# EAGLE schematic Schaltplan (EAGLE 6.5.0)
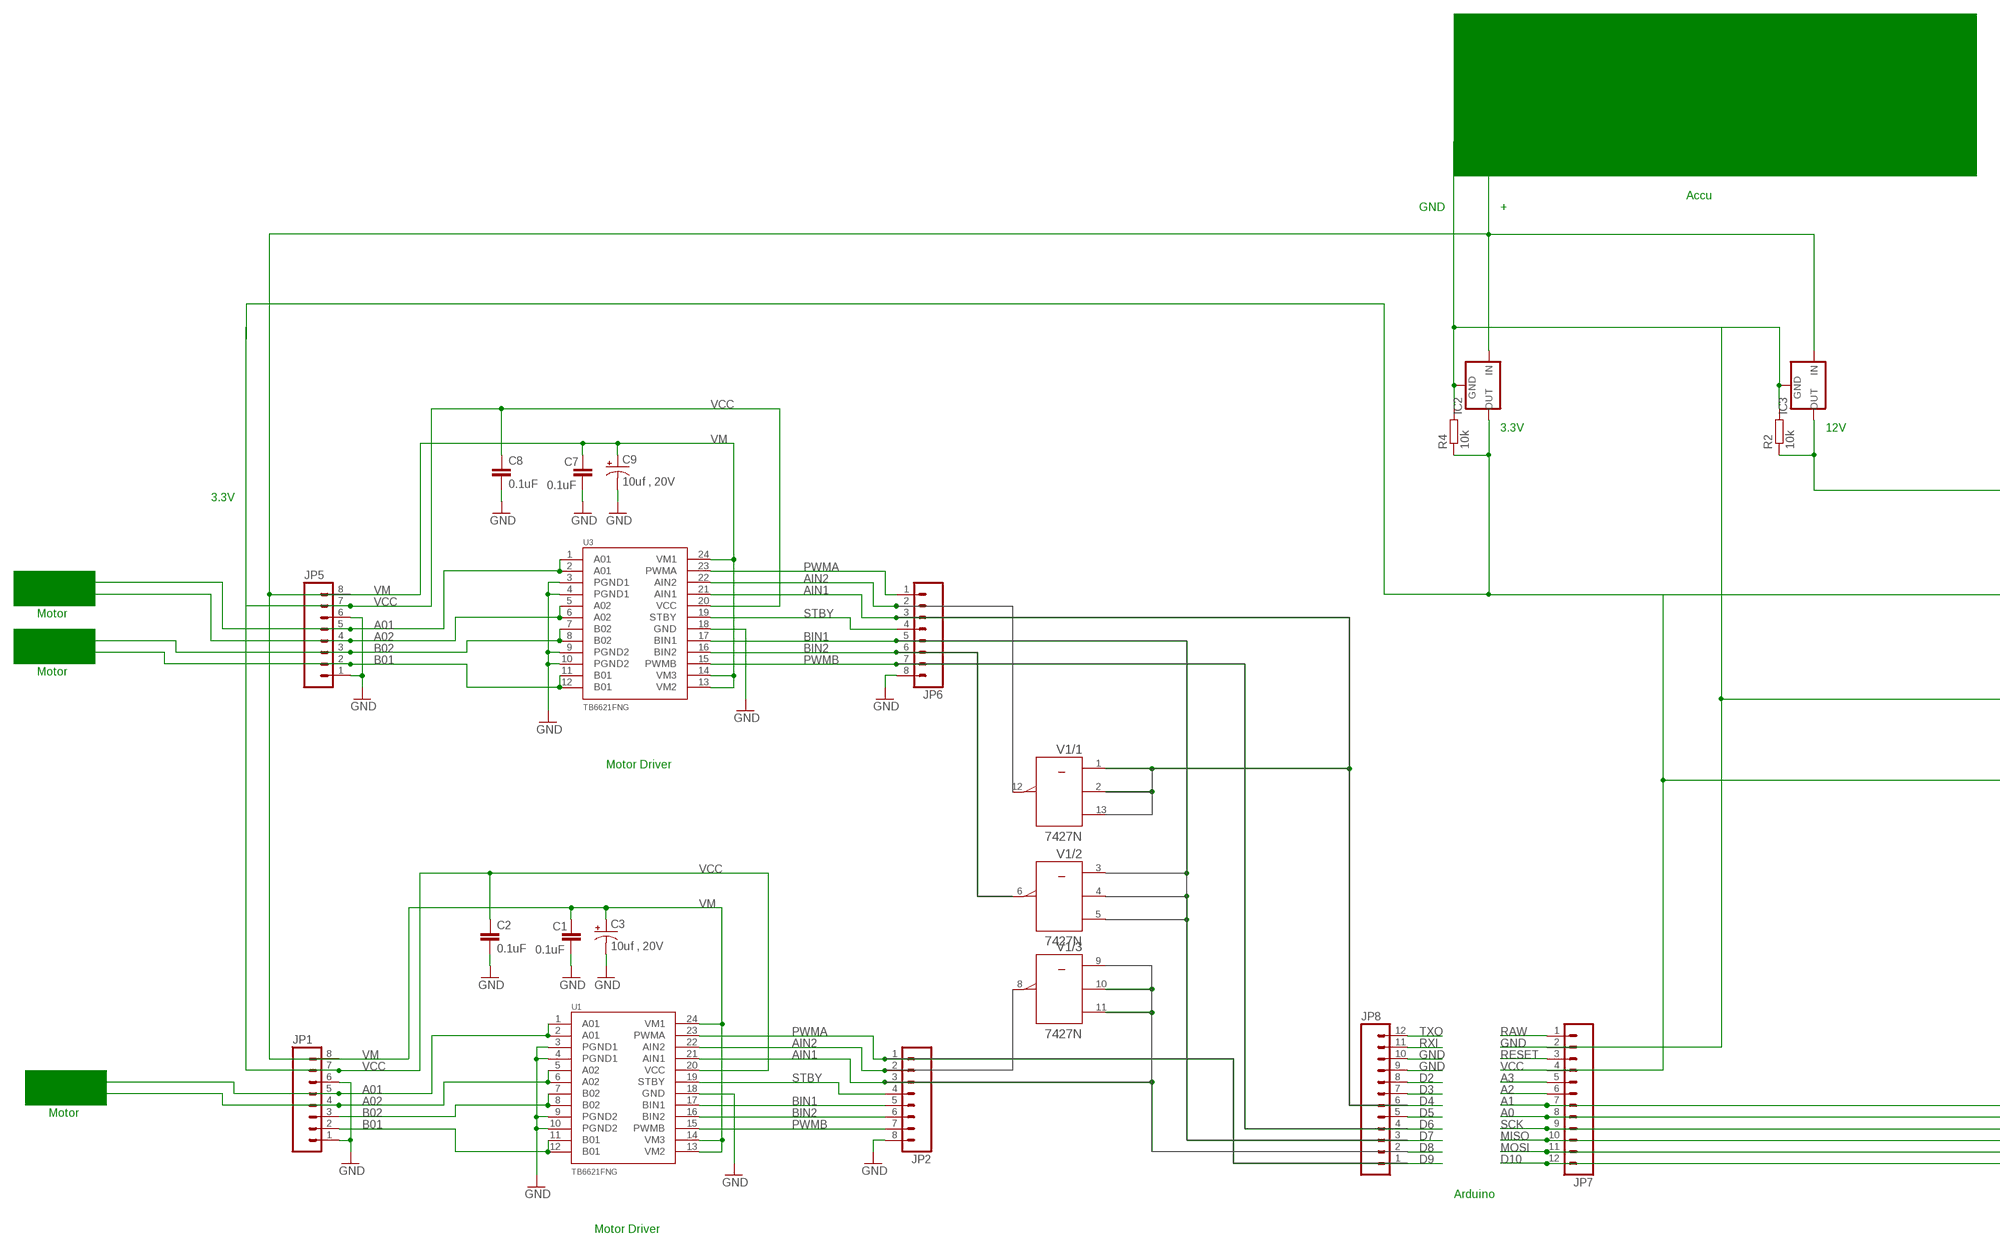
[diagram p0: schematic, sheet 1, part 1 of 2]
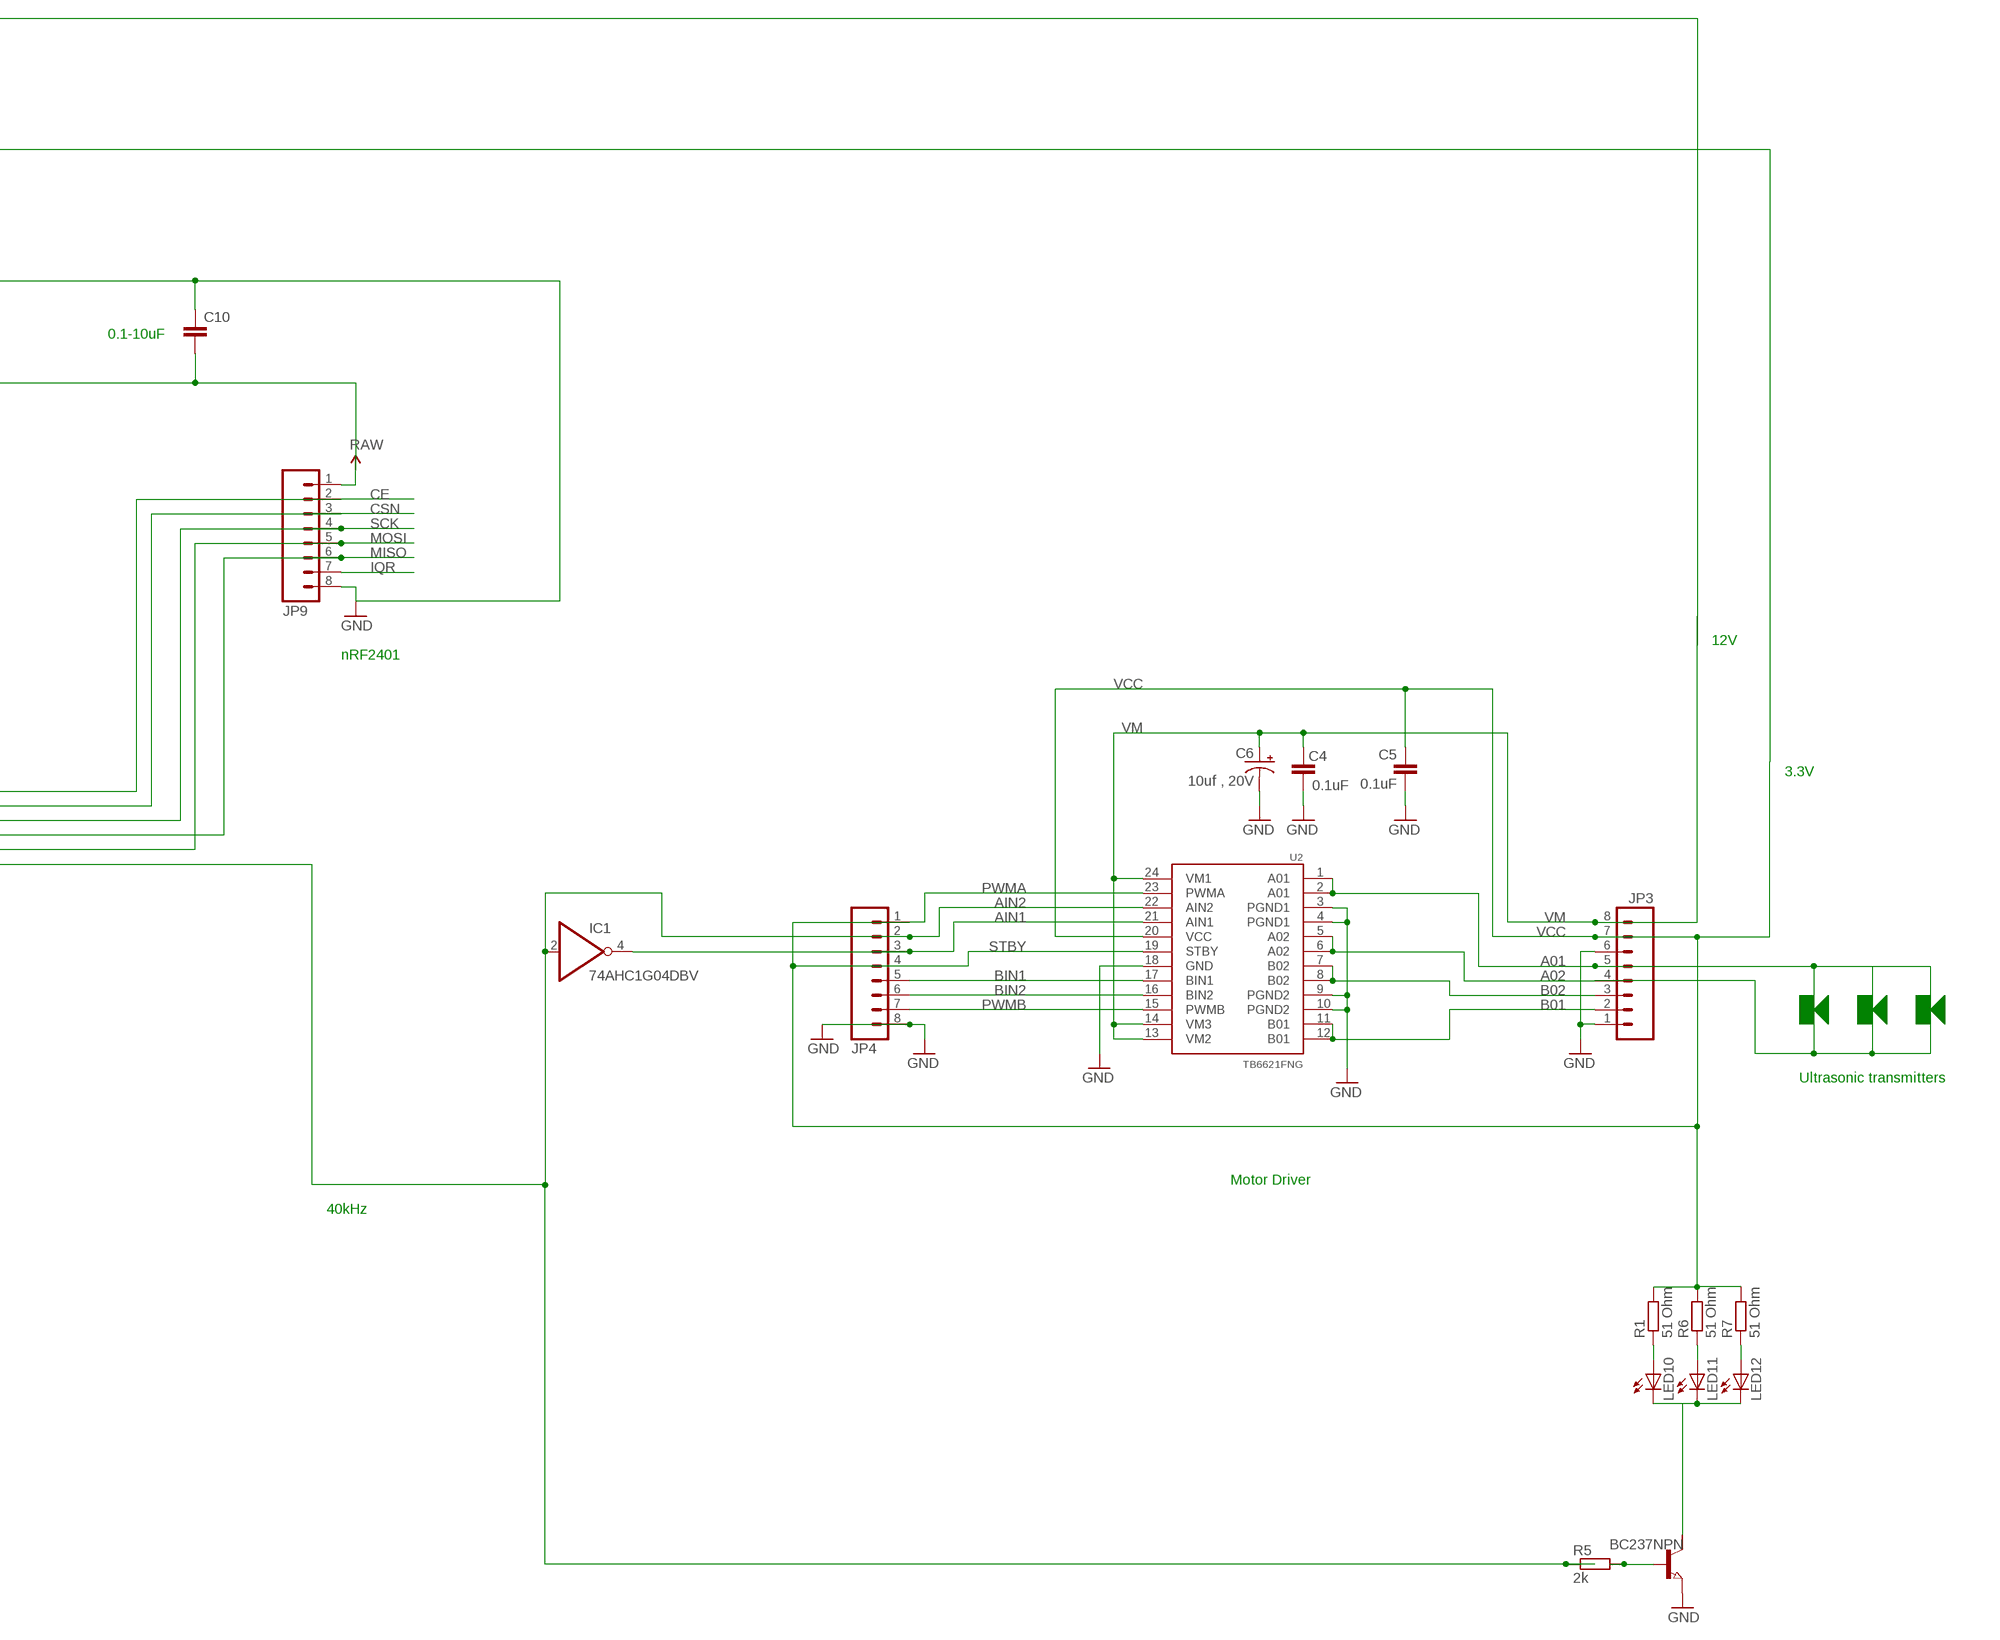
[diagram p1: schematic, sheet 1, part 2 of 2]

## Parts
BC237NPN  NPN-TRANSISTIOR-2COLSOT89  [SOT89]
C1  0.1uF  CAP0402-CAP  [0402-CAP]
C2  0.1uF  CAP0402-CAP  [0402-CAP]
C3  10uf , 20V  CAP_POL3528  [EIA3528]
C4  0.1uF  CAP0402-CAP  [0402-CAP]
C5  0.1uF  CAP0402-CAP  [0402-CAP]
C6  10uf , 20V  CAP_POL3528  [EIA3528]
C7  0.1uF  CAP0402-CAP  [0402-CAP]
C8  0.1uF  CAP0402-CAP  [0402-CAP]
C9  10uf , 20V  CAP_POL3528  [EIA3528]
C10  C2,5-3  [C2.5-3]
IC1  74AHC1G04DBV  [SOT23-5]
IC2  LM323-TO3  [TO3-K02]
IC3  LM323-TO3  [TO3-K02]
JP1  M08LONGPADS  [1X08_LONGPADS]
JP2  M08LONGPADS  [1X08_LONGPADS]
JP3  M08LONGPADS  [1X08_LONGPADS]
JP4  M08LONGPADS  [1X08_LONGPADS]
JP5  M08LONGPADS  [1X08_LONGPADS]
JP6  M08LONGPADS  [1X08_LONGPADS]
JP7  M12PTH  [1X12]
JP8  M12PTH  [1X12]
JP9  M081X08  [1X08]
LED10  LED  [SMARTLED-TTW]
LED11  LED  [SMARTLED-TTW]
LED12  LED  [SMARTLED-TTW]
R1  51 Ohm  R-EU_0204/2V  [0204V]
R2  10k  R-EU_0204/2V  [0204V]
R4  10k  R-EU_0204/2V  [0204V]
R5  2k  R-EU_0204/2V  [0204V]
R6  51 Ohm  R-EU_0204/2V  [0204V]
R7  51 Ohm  R-EU_0204/2V  [0204V]
U1  TB6621FNG  [SSOP24]
U2  TB6621FNG  [SSOP24]
U3  TB6621FNG  [SSOP24]
V1  7427N  [DIL14]

## Nets
A0: JP7.8
A01: JP1.5 JP3.5 JP5.5 U1.1(A01) U1.2(A01) U2.1(A01) U2.2(A01) U3.1(A01) U3.2(A01)
A1: JP7.7
A02: JP1.4 JP3.4 JP5.4 U1.5(A02) U1.6(A02) U2.5(A02) U2.6(A02) U3.5(A02) U3.6(A02)
A2: JP7.6
A3: JP7.5
AIN1: IC1.4(O) JP2.3 JP4.3 JP6.3 U1.21(AIN1) U2.21(AIN1) U3.21(AIN1) V1.1(/1:A) V1.2(/1:B) V1.9(/3:A) V1.10(/3:B) V1.11(/3:C) V1.13(/1:C)
AIN2: IC1.2(I) JP2.2 JP4.2 JP6.2 R5.1 U1.22(AIN2) U2.22(AIN2) U3.22(AIN2) V1.8(/3:Y) V1.12(/1:Y)
B01: JP1.2 JP3.2 JP5.2 U1.11(B01) U1.12(B01) U2.11(B01) U2.12(B01) U3.11(B01) U3.12(B01)
B02: JP1.3 JP3.3 JP5.3 U1.7(B02) U1.8(B02) U2.7(B02) U2.8(B02) U3.7(B02) U3.8(B02)
BIN1: JP2.5 JP4.5 JP6.5 U1.17(BIN1) U2.17(BIN1) U3.17(BIN1) V1.3(/2:A) V1.4(/2:B) V1.5(/2:C)
BIN2: JP2.6 JP4.6 JP6.6 U1.16(BIN2) U2.16(BIN2) U3.16(BIN2) V1.6(/2:Y)
CE: JP9.2
CSN: JP9.3
D2: JP8.8
D3: JP8.7
D4: JP8.6
D5: JP8.5
D6: JP8.4
D7: JP8.3
D8: JP8.2
D9: JP8.1
D10: JP7.12
GND: BC237NPN.3(E) C1.2 C2.2 C3.C(-) C4.2 C5.2 C6.C(-) C7.2 C8.2 C9.C(-) JP1.1 JP1.6 JP2.8 JP3.1 JP3.6 JP4.8 JP5.1 JP5.6 JP6.8 JP7.2 JP8.9 JP8.10 JP9.8 U1.3(PGND1) U1.4(PGND1) U1.9(PGND2) U1.10(PGND2) U1.18(GND) U2.3(PGND1) U2.4(PGND1) U2.9(PGND2) U2.10(PGND2) U2.18(GND) U3.3(PGND1) U3.4(PGND1) U3.9(PGND2) U3.10(PGND2) U3.18(GND)
IQR: JP9.7
MISO: JP7.10 JP9.6
MOSI: JP7.11 JP9.5
N$2: IC2.2(IN) IC3.2(IN)
N$3: C10.1 IC2.3(GND) IC3.3(GND) R2.2 R4.2
N$4: LED10.A@1(A) R1.1
N$5: LED11.A@1(A) R6.1
N$6: LED12.A@1(A) R7.1
N$7: C10.2 IC2.1(OUT) R4.1
N$8: IC3.1(OUT) R2.1
N$10: BC237NPN.1(B) R5.2
N$11: BC237NPN.2(C) LED10.C@1(C) LED11.C@1(C) LED12.C@1(C)
PWMA: JP2.1 JP4.1 JP6.1 U1.23(PWMA) U2.23(PWMA) U3.23(PWMA)
PWMB: JP2.7 JP4.7 JP6.7 U1.15(PWMB) U2.15(PWMB) U3.15(PWMB)
RAW [vcc]: JP7.1 JP9.1
RESET: JP7.3
RXI: JP8.11
SCK: JP7.9 JP9.4
STBY: JP2.4 JP4.4 JP6.4 U1.19(STBY) U2.19(STBY) U3.19(STBY)
TXO: JP8.12
VCC: C2.1 C5.1 C8.1 JP1.7 JP3.7 JP5.7 JP7.4 R1.2 R6.2 R7.2 U1.20(VCC) U2.20(VCC) U3.20(VCC)
VM: C1.1 C3.A(+) C4.1 C6.A(+) C7.1 C9.A(+) JP1.8 JP3.8 JP5.8 U1.13(VM2) U1.14(VM3) U1.24(VM1) U2.13(VM2) U2.14(VM3) U2.24(VM1) U3.13(VM2) U3.14(VM3) U3.24(VM1)
Unconnected: BC237NPN.2@1(C/)

## Notes on the sheet
- Accu
- GND | +
- 3.3V | 12V
- 3.3V
- Motor
- Motor
- Motor
- 0.1-10uF
- Motor Driver
- 12V
- nRF2401
- 3.3V
- Motor
- Arduino
- Motor Driver
- Ultrasonic transmitters
- Motor Driver
- 40kHz

## Power pins joined to a net without a drawn wire
+UB: V1.14(/+UB:+UB)
-UB: V1.7(/-UB:-UB)
GND: IC1.3(GND)
VCC: IC1.5(VCC)

## Library data of the parts
BC237NPN = semicon-smd-ipc:NPN-TRANSISTIOR-2COL: NPN TRANSISTOR 2 colletor pins
C1 C2 C4 C5 C7 C8 = SparkFun:CAP: Capacitor Standard 0603 ceramic capacitor, and 0.1" leaded capacitor.
C3 C6 C9 = SparkFun:CAP_POL: Capacitor Polarized These are standard SMD and PTH capacitors. Normally 10uF, 47uF, and 100uF in electrolytic and tantalum varieties. Always verify the external diameter of the through hole cap, it varies with capacity, voltage, and manufacturer. The EIA devices should be standard.
C10 = capacitor-wima:C: CAPACITOR naming: grid - package width
IC1 = 74xx-little-de:74*1G04: INVERTER Gate
IC2 IC3 = v-reg:LM323-TO3: VOLTAGE REGULATOR
JP1-JP6 JP9 = SparkFun:M08: Header 8 Standard 8-pin 0.1" header. Use with straight break away headers (SKU : PRT-00116), right angle break away headers (PRT-00553), swiss pins (PRT-00743), machine pins (PRT-00117), and female headers (PRT-00115).
JP7 JP8 = SparkFun:M12: Header 12 Standard 12-pin 0.1" header. Use with straight break away headers (SKU : PRT-00116), right angle break away headers (PRT-00553), swiss pins (PRT-00743), machine pins (PRT-00117), and female headers (PRT-00115).
LED10-LED12 = led:LED: LED OSRAM: - CHIPLED LG R971, LG N971, LY N971, LG Q971, LY Q971, LO R971, LY R971 LH N974, LH R974 LS Q976, LO Q976, LY Q976 LO Q996 - Hyper CHIPLED LW Q18S LB Q993, LB Q99A, LB R99A - SideLED LS A670, LO A670, LY A670, LG A670, LP A670 LB A673, LV A673, LT A673, LW A673 LH A674 LY A675 LS A676, LA A676, LO A676, LY A676, LW A676 LS A679, LY A679, LG A679 - Hyper Micro SIDELED® LS Y876, LA Y876, LO Y876, LY Y876 LT Y87S - SmartLED LW L88C, LW L88S LB L89C, LB L89S, LG L890 LS L89K, LO L89K, LY L89K LS L896, LA L896, LO L896, LY L896 - TOPLED LS T670, LO T670, LY T670, LG T670, LP T670 LSG T670, LSP T670, LSY T670, LOP T670, LYG T670 LG T671, LOG T671, LSG T671 LB T673, LV T673, LT T673, LW T673 LH T674 LS T676, LA T676, LO T676, LY T676, LB T676, LH T676, LSB T676, LW T676 LB T67C, LV T67C, LT T67C, LS T67K, LO T67K, LY T67K, LW E67C LS E67B, LA E67B, LO E67B, LY E67B, LB E67C, LV E67C, LT E67C LW T67C LS T679, LY T679, LG T679 LS T770, LO T770, LY T770, LG T770, LP T770 LB T773, LV T773, LT T773, LW T773 LH T774 LS E675, LA E675, LY E675, LS T675 LS T776, LA T776, LO T776, LY T776, LB T776 LHGB T686 LT T68C, LB T68C - Hyper Mini TOPLED® LB M676 - Mini TOPLED Santana® LG M470 LS M47K, LO M47K, LY M47K Source: http://www.osram.convergy.de LUXEON: - LUMILED® LXK2-PW12-R00, LXK2-PW12-S00, LXK2-PW14-U00, LXK2-PW14-V00 LXK2-PM12-R00, LXK2-PM12-S00, LXK2-PM14-U00 LXK2-PE12-Q00, LXK2-PE12-R00, LXK2-PE12-S00, LXK2-PE14-T00, LXK2-PE14-U00 LXK2-PB12-K00, LXK2-PB12-L00, LXK2-PB12-M00, LXK2-PB14-N00, LXK2-PB14-P00, LXK2-PB14-Q00 LXK2-PR12-L00, LXK2-PR12-M00, LXK2-PR14-Q00, LXK2-PR14-R00 LXK2-PD12-Q00, LXK2-PD12-R00, LXK2-PD12-S00 LXK2-PH12-R00, LXK2-PH12-S00 LXK2-PL12-P00, LXK2-PL12-Q00, LXK2-PL12-R00 Source: www.luxeon.com KINGBRIGHT: KA-3528ASYC Source: www.kingbright.com
R1 R2 R4-R7 = resistor:R-EU_: RESISTOR, European symbol
U1-U3 = SparkFun:TB6621FNG: Toshiba 1A motor driver
V1 = 74ttl-din:74*27: Triple 3-input NOR gate